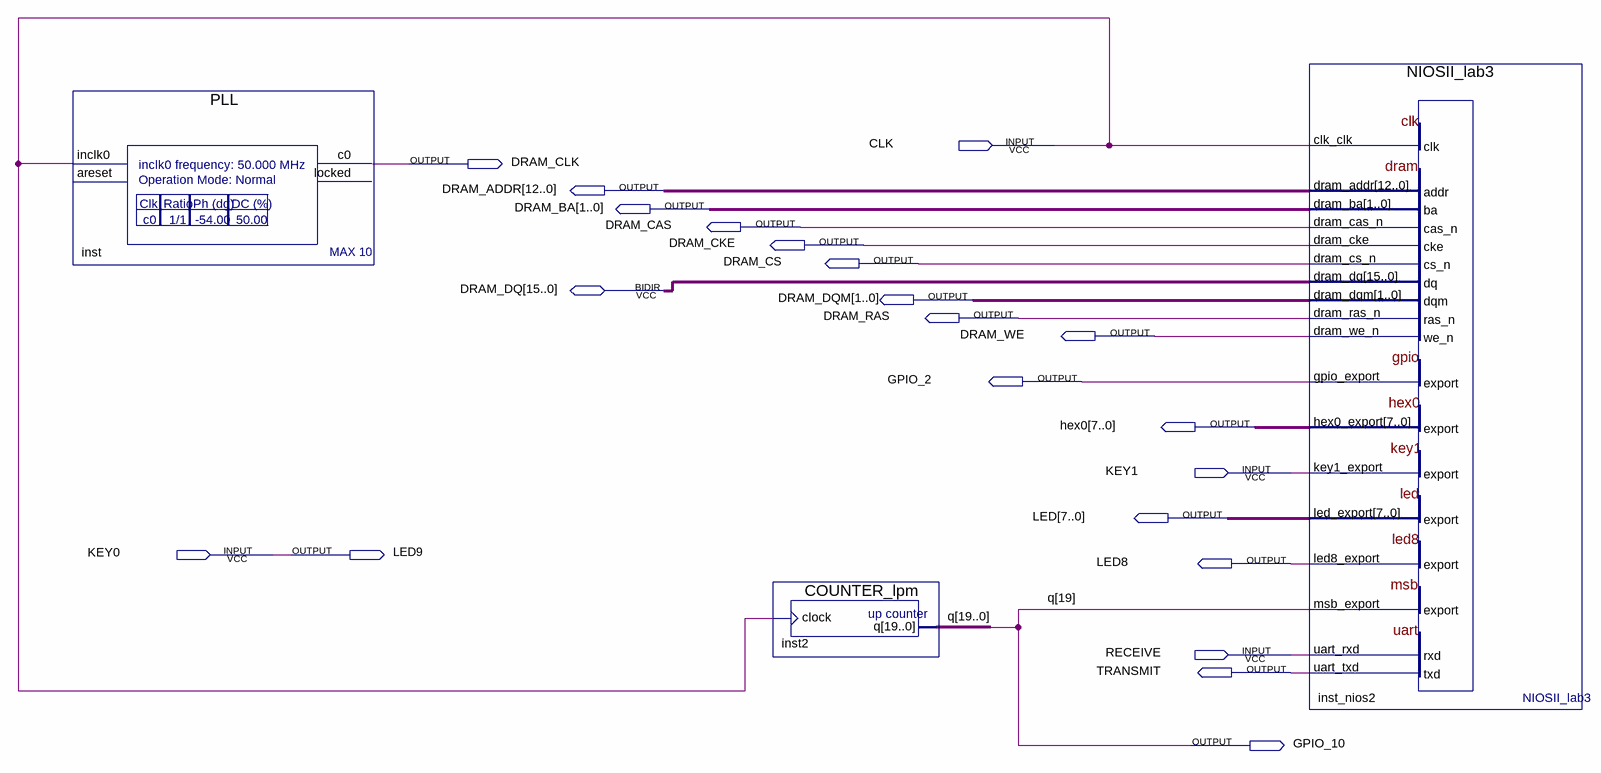
[diagram p0: schematic sheet]
// Quartus schematic Week5_lab4.bdf as structural Verilog: 3 symbols, 21 pins
module Week5_lab4 (
  input  CLK,
  input  KEY1,
  input  KEY0,
  input  RECEIVE,
  inout  [15:0] DRAM_DQ,
  output DRAM_CLK,
  output [12:0] DRAM_ADDR,
  output [1:0] DRAM_BA,
  output DRAM_CAS,
  output DRAM_CKE,
  output DRAM_CS,
  output [1:0] DRAM_DQM,
  output DRAM_RAS,
  output DRAM_WE,
  output GPIO_2,
  output [7:0] hex0,
  output [7:0] LED,
  output LED9,
  output LED8,
  output TRANSMIT,
  output GPIO_10
);

  wire [18:0] q;

  PLL inst (.inclk0(CLK), .c0(DRAM_CLK));  // open: areset, locked
  COUNTER_lpm inst2 (.clock(CLK), .q({GPIO_10, q}));
  NIOSII_lab3 inst_nios2 (
    .clk_clk(CLK), .key1_export(KEY1), .msb_export(GPIO_10), .uart_rxd(RECEIVE), .dram_addr(DRAM_ADDR),
    .dram_ba(DRAM_BA), .dram_cas_n(DRAM_CAS), .dram_cke(DRAM_CKE), .dram_cs_n(DRAM_CS), .dram_dqm(DRAM_DQM),
    .dram_ras_n(DRAM_RAS), .dram_we_n(DRAM_WE), .gpio_export(GPIO_2), .hex0_export(hex0), .led_export(LED),
    .led8_export(LED8), .uart_txd(TRANSMIT), .dram_dq(DRAM_DQ));

  assign LED9 = KEY0;

  // Other names for the same wires on the sheet: q[19] = GPIO_10
endmodule
